# EAGLE design RezzFuzz2 (EAGLE 6.3)
RezFuzz: Based on TurboRat plus Octaver

## Sheet 1 of 2
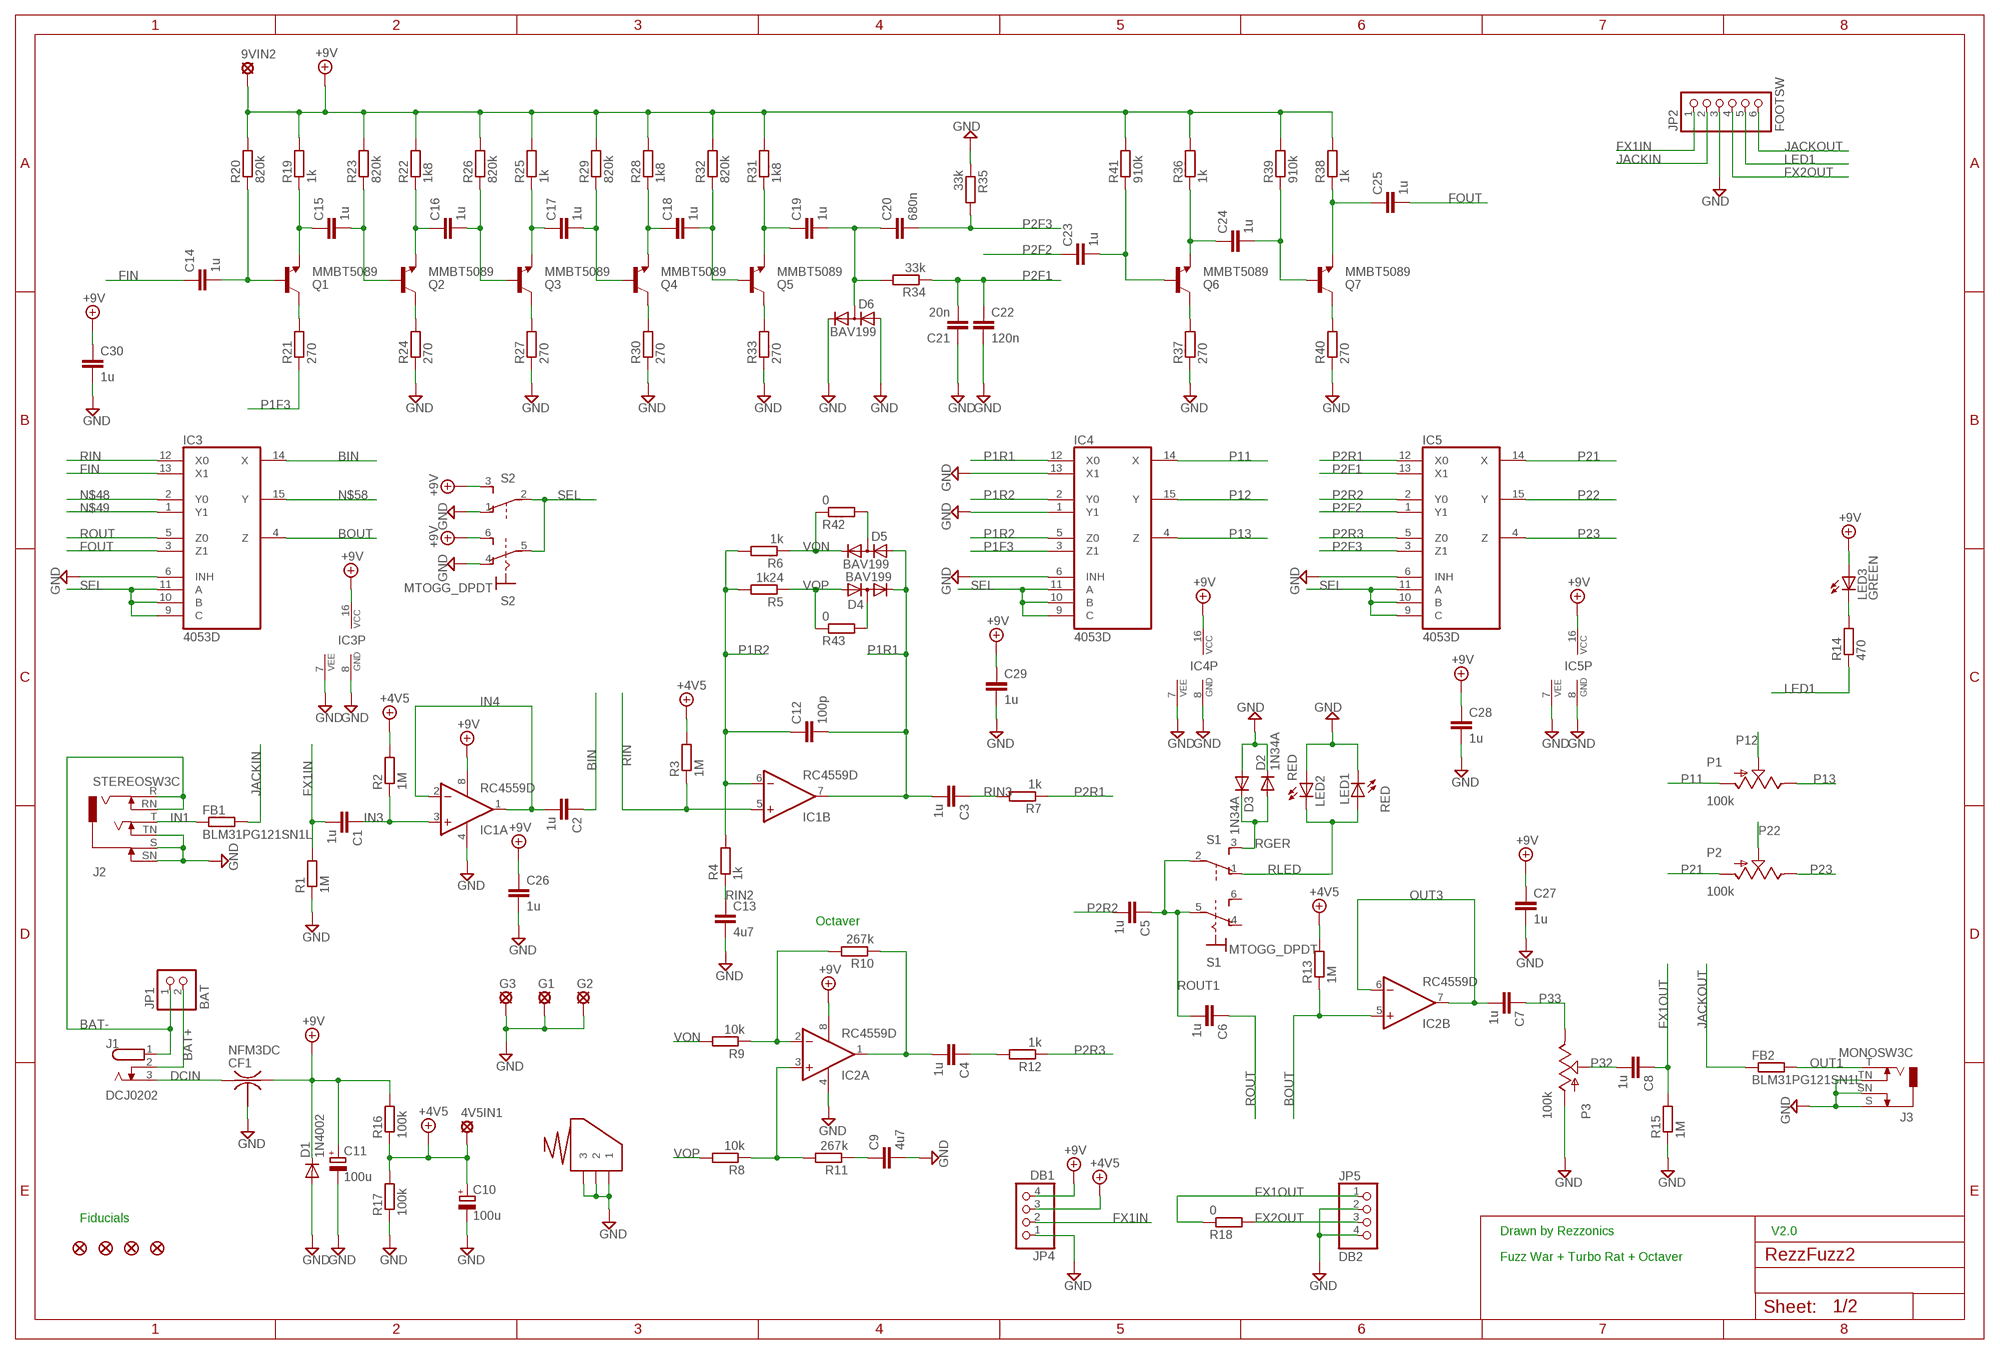
[diagram p0: schematic, sheet 1]

### Parts
4V5IN1  LSP13  [LSP13]
9VIN2  LSP13  [LSP13]
BS1  CLIPAAA-  [CLIPAAA-]
C1  1u  C-EUC0603  [C0603]
C2  1u  C-EUC0603  [C0603]
C3  1u  C-EUC0603  [C0603]
C4  1u  C-EUC0603  [C0603]
C5  1u  C-EUC0603  [C0603]
C6  1u  C-EUC0603  [C0603]
C7  1u  C-EUC0603  [C0603]
C8  1u  C-EUC0603  [C0603]
C9  4u7  C-EUC0805  [C0805]
C10  100u  CPOL-EUD  [PANASONIC_D]
C11  100u  CPOL-EUD  [PANASONIC_D]
C12  100p  C-EUC0603  [C0603]
C13  4u7  C-EUC0805  [C0805]
C14  1u  C-EUC0603  [C0603]
C15  1u  C-EUC0603  [C0603]
C16  1u  C-EUC0603  [C0603]
C17  1u  C-EUC0603  [C0603]
C18  1u  C-EUC0603  [C0603]
C19  1u  C-EUC0603  [C0603]
C20  680n  C-EUC0603  [C0603]
C21  20n  C-EUC0603  [C0603]
C22  120n  C-EUC0603  [C0603]
C23  1u  C-EUC0603  [C0603]
C24  1u  C-EUC0603  [C0603]
C25  1u  C-EUC0603  [C0603]
C26  1u  C-EUC0603  [C0603]
C27  1u  C-EUC0603  [C0603]
C28  1u  C-EUC0603  [C0603]
C29  1u  C-EUC0603  [C0603]
C30  1u  C-EUC0603  [C0603]
CF1  NFM3DC  [NFM3DC]
D1  1N4002  DIODE-DO41-7.6  [DO41-7.6]
D2  1N34A  1N4148DO35-7  [DO35-7]
D3  1N34A  1N4148DO35-7  [DO35-7]
D4  BAV199  [SOT23]
D5  BAV199  [SOT23]
D6  BAV199  [SOT23]
FB1  BLM31PG121SN1L  R-EU_R1206  [R1206]
FB2  BLM31PG121SN1L  R-EU_R1206  [R1206]
G1  LSP13  [LSP13]
G2  LSP13  [LSP13]
G3  LSP13  [LSP13]
IC1  RC4559D  [SO08]
IC2  RC4559D  [SO08]
IC3  4053D  [SO16]
IC4  4053D  [SO16]
IC5  4053D  [SO16]
J1  DCJ0202  [DCJ0202]
J2  STEREOSW3C  [NEUTRIK-NMJ6HCD2]
J3  MONOSW3C  [NEUTRIK-NMJ4HCD2]
JP1  BAT  PINHD-1X2  [1X02]
JP2  FOOTSW  PINHD-1X6  [1X06]
JP3  FIDUCIAL1X2.5  [FIDUCIAL-1X2.5]
JP4  DB1  PINHD-1X4  [1X04]
JP5  DB2  PINHD-1X4  [1X04]
JP6  FIDUCIAL1X2.5  [FIDUCIAL-1X2.5]
JP7  FIDUCIAL1X2.5  [FIDUCIAL-1X2.5]
JP8  FIDUCIAL1X2.5  [FIDUCIAL-1X2.5]
LED1  RED  LEDCHIPLED_1206  [CHIPLED_1206]
LED2  RED  LEDCHIPLED_1206  [CHIPLED_1206]
LED3  GREEN  LED5MM  [LED5MM]
P1  100k  POTMAM  [POT_MAMMOTH]
P2  100k  POTMAM  [POT_MAMMOTH]
P3  100k  POTMAM  [POT_MAMMOTH]
Q1  MMBT5089  TRANSISTOR_NPNSOT23  [SOT23]
Q2  MMBT5089  TRANSISTOR_NPNSOT23  [SOT23]
Q3  MMBT5089  TRANSISTOR_NPNSOT23  [SOT23]
Q4  MMBT5089  TRANSISTOR_NPNSOT23  [SOT23]
Q5  MMBT5089  TRANSISTOR_NPNSOT23  [SOT23]
Q6  MMBT5089  TRANSISTOR_NPNSOT23  [SOT23]
Q7  MMBT5089  TRANSISTOR_NPNSOT23  [SOT23]
R1  1M  R-EU_R0603  [R0603]
R2  1M  R-EU_R0603  [R0603]
R3  1M  R-EU_R0603  [R0603]
R4  1k  R-EU_R0603  [R0603]
R5  1k24  R-EU_R0603  [R0603]
R6  1k  R-EU_R0603  [R0603]
R7  1k  R-EU_R0603  [R0603]
R8  10k  R-EU_R0603  [R0603]
R9  10k  R-EU_R0603  [R0603]
R10  267k  R-EU_R0603  [R0603]
R11  267k  R-EU_R0603  [R0603]
R12  1k  R-EU_R0603  [R0603]
R13  1M  R-EU_R0603  [R0603]
R14  470  R-EU_R0603  [R0603]
R15  1M  R-EU_R0603  [R0603]
R16  100k  R-EU_R0603  [R0603]
R17  100k  R-EU_R0603  [R0603]
R18  0  R-EU_R0603  [R0603]
R19  1k  R-EU_R0603  [R0603]
R20  820k  R-EU_R0603  [R0603]
R21  270  R-EU_R0603  [R0603]
R22  1k8  R-EU_R0603  [R0603]
R23  820k  R-EU_R0603  [R0603]
R24  270  R-EU_R0603  [R0603]
R25  1k  R-EU_R0603  [R0603]
R26  820k  R-EU_R0603  [R0603]
R27  270  R-EU_R0603  [R0603]
R28  1k8  R-EU_R0603  [R0603]
R29  820k  R-EU_R0603  [R0603]
R30  270  R-EU_R0603  [R0603]
R31  1k8  R-EU_R0603  [R0603]
R32  820k  R-EU_R0603  [R0603]
R33  270  R-EU_R0603  [R0603]
R34  33k  R-EU_R0603  [R0603]
R35  33k  R-EU_R0603  [R0603]
R36  1k  R-EU_R0603  [R0603]
R37  270  R-EU_R0603  [R0603]
R38  1k  R-EU_R0603  [R0603]
R39  910k  R-EU_R0603  [R0603]
R40  270  R-EU_R0603  [R0603]
R41  910k  R-EU_R0603  [R0603]
R42  0  R-EU_R0603  [R0603]
R43  0  R-EU_R0603  [R0603]
S1  MTOGG_DPDT  [MTOGGLE_DPDT]
S2  MTOGG_DPDT  [MTOGGLE_DPDT]

### Nets
+4.5V: 4V5IN1.MP C10.+ JP4.3 R2.2 R3.2 R13.2 R16.1 R17.2 ; supply symbol labelled +4V5
+9V: 9VIN2.MP C11.+ C26.1 C27.1 C28.1 C29.1 C30.1 CF1.3 D1.C IC1.8(P:V+) IC2.8(P:V+) IC3.16(VCC) IC4.16(VCC) IC5.16(VCC) JP4.4 LED3.A R16.2 R19.2 R20.2 R22.2 R23.2 R25.2 R26.2 R28.2 R29.2 R31.2 R32.2 R36.2 R38.2 R39.2 R41.2 S2.3(S) S2.6(S)
BAT+ [battery]: J1.2 JP1.2
BAT- [battery]: J1.1 J2.R J2.RN JP1.1
BIN: C2.1 IC3.14(X)
BOUT: IC2.5(B:+IN) IC3.4(Z) R13.1
DCIN: CF1.1 J1.3
FIN: C14.1 IC3.13(X1)
FOUT: C25.2 IC3.3(Z1)
FX1IN: C1.2 JP2.1 JP4.2 R1.2
FX1OUT: C8.1 JP5.1 R15.2 R18.1
FX2OUT: JP2.4 JP5.3 R18.2
GND: BS1.1 BS1.2 BS1.3 C9.2 C10.- C11.- C13.2 C21.1 C22.2 C26.2 C27.2 C28.2 C29.2 C30.2 CF1.2@1 D1.A D2.C D3.A D6.1(A) D6.2(C) G1.MP G2.MP G3.MP IC1.4(P:V-) IC2.4(P:V-) IC3.6(INH) IC3.7(VEE) IC3.8(GND) IC4.1(Y1) IC4.6(INH) IC4.7(VEE) IC4.8(GND) IC4.13(X1) IC5.6(INH) IC5.7(VEE) IC5.8(GND) J2.S J2.SN J2.TN J3.S J3.SN J3.TN JP2.3 JP4.1 JP5.2 JP5.4 LED1.C LED2.A P3.P$1(A) R1.1 R15.1 R17.1 R24.1 R27.1 R30.1 R33.1 R35.1 R37.1 R40.1 S2.1(O) S2.4(O)
IN1: FB1.1 J2.T
IN3: C1.1 IC1.3(A:+IN) R2.1
IN4: C2.2 IC1.1(A:OUT) IC1.2(A:-IN)
JACKIN: FB1.2 JP2.2
JACKOUT: FB2.1 JP2.6
LED1: JP2.5 R14.1
N$1: C14.2 Q1.1(B) R20.1
N$2: Q1.3(C) R21.2
N$3: C16.1 Q2.2(E) R22.1
N$5: Q2.3(C) R24.2
N$8: C16.2 Q3.1(B) R26.1
N$9: C17.1 Q3.2(E) R25.1
N$10: IC2.3(A:+IN) R8.1 R11.2
N$11: IC2.2(A:-IN) R9.1 R10.2
N$12: C9.1 R11.1
N$13: C4.2 IC2.1(A:OUT) R10.1
N$14: C4.1 R12.2
N$15: Q3.3(C) R27.2
N$16: C17.2 Q4.1(B) R29.1
N$17: C18.1 Q4.2(E) R28.1
N$18: Q4.3(C) R30.2
N$19: C18.2 Q5.1(B) R32.1
N$20: C19.1 Q5.2(E) R31.1
N$21: D5.3(AC) R42.2
N$23: Q5.3(C) R33.2
N$24: C19.2 C20.1 D6.3(AC) R34.2
N$25: C24.2 Q7.1(B) R39.1
N$26: C23.2 Q6.1(B) R41.1
N$27: C24.1 Q6.2(E) R36.1
N$29: C25.1 Q7.2(E) R38.1
N$30: Q7.3(C) R40.2
N$31: Q6.3(C) R37.2
N$32: LED3.K(C) R14.2
N$33: C15.2 Q2.1(B) R23.1
N$43: D4.3(AC) R43.2
N$47: C15.1 Q1.2(E) R19.1
N$48: IC3.2(Y0)
N$49: IC3.1(Y1)
N$58: IC3.15(Y)
OUT1: FB2.2 J3.T
OUT3: C7.2 IC2.6(B:-IN) IC2.7(B:OUT)
P1F3: IC4.3(Z1) R21.1
P1R1: C3.2 C12.2 D4.2(C) D5.1(A) IC1.7(B:OUT) IC4.12(X0)
P1R2: C12.1 IC1.6(B:-IN) IC4.2(Y0) IC4.5(Z0) R4.2 R5.2 R6.2
P2F1: C21.2 C22.1 IC5.13(X1) R34.1
P2F2: C23.1 IC5.1(Y1)
P2F3: C20.2 IC5.3(Z1) R35.2
P2R1: IC5.12(X0) R7.1
P2R2: C5.2 IC5.2(Y0)
P2R3: IC5.5(Z0) R12.1
P11: IC4.14(X) P1.P$1(A)
P12: IC4.15(Y) P1.P$2(S)
P13: IC4.4(Z) P1.P$3(E)
P21: IC5.14(X) P2.P$1(A)
P22: IC5.15(Y) P2.P$2(S)
P23: IC5.4(Z) P2.P$3(E)
P32: C8.2 P3.P$2(S)
P33: C7.1 P3.P$3(E)
RGER: D2.A D3.C S1.3(S)
RIN: IC1.5(B:+IN) IC3.12(X0) R3.1
RIN2: C13.1 R4.1
RIN3: C3.1 R7.2
RLED: LED1.A LED2.C S1.1(O)
ROUT: C6.1 IC3.5(Z0)
ROUT1: C5.1 C6.2 S1.2(P) S1.5(P)
SEL: IC3.9(C) IC3.10(B) IC3.11(A) IC4.9(C) IC4.10(B) IC4.11(A) IC5.9(C) IC5.10(B) IC5.11(A) S2.2(P) S2.5(P)
VON: D5.2(C) R6.1 R9.2 R42.1
VOP: D4.1(A) R5.1 R8.2 R43.1
Unconnected: CF1.2@2 S1.4(O) S1.6(S)

### Notes on the sheet
- Octaver
- Fiducials
- Drawn by Rezzonics | V2.0
- Fuzz War + Turbo Rat + Octaver

## Sheet 2 of 2
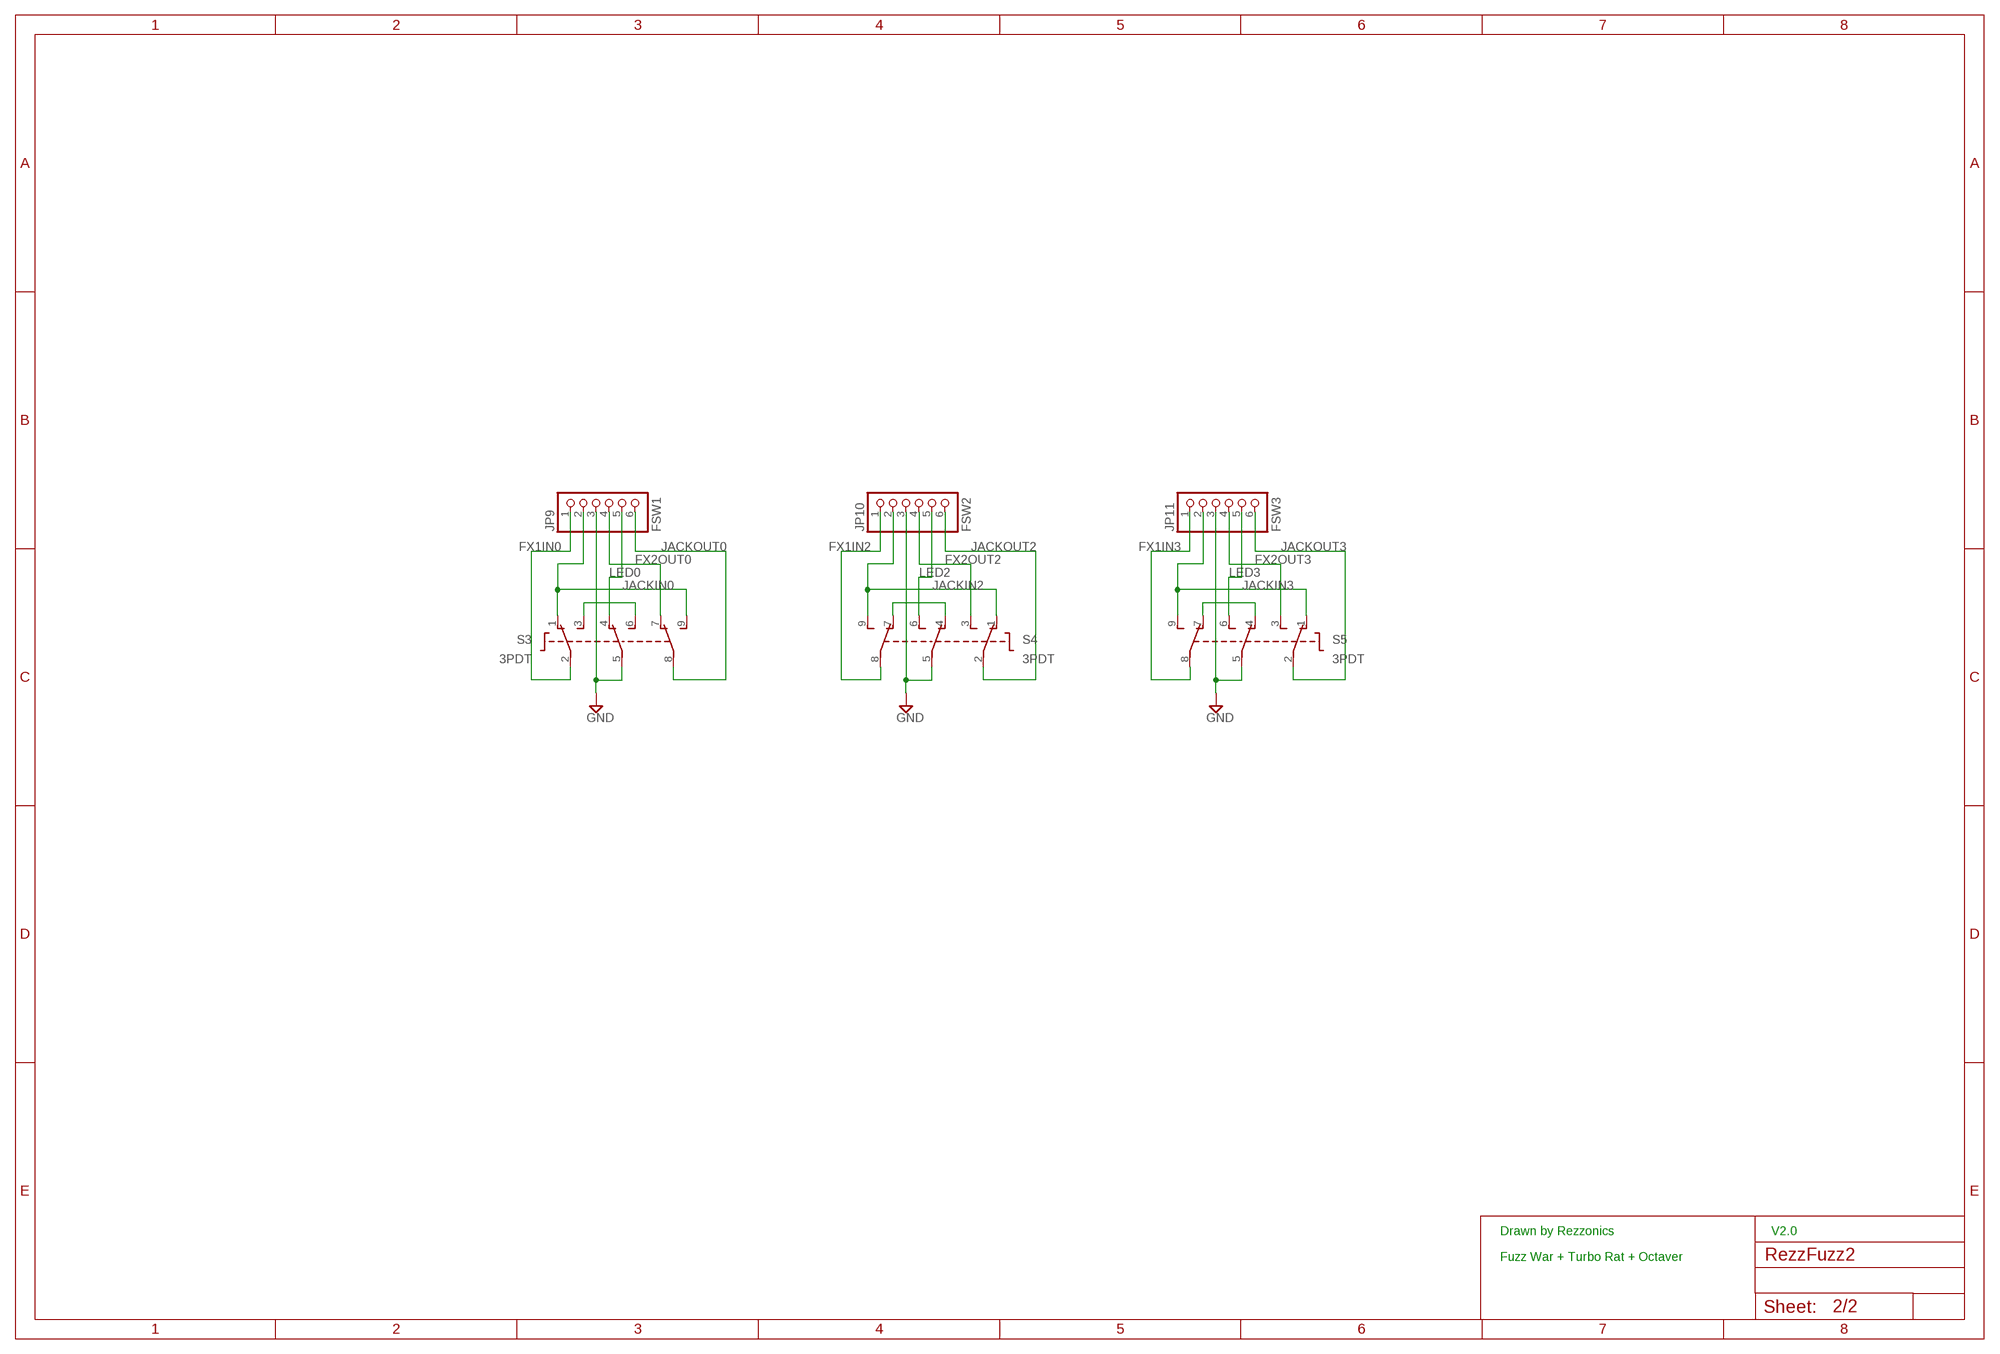
[diagram p1: schematic, sheet 2]

### Parts
JP9  FSW1  PINHD-1X6  [1X06]
JP10  FSW2  PINHD-1X6  [1X06]
JP11  FSW3  PINHD-1X6  [1X06]
S3  3PDT  [3PDT]
S4  3PDT  [3PDT]
S5  3PDT  [3PDT]

### Nets
FX1IN0: JP9.1 S3.2(P1)
FX1IN2: JP10.1 S4.8(P3)
FX1IN3: JP11.1 S5.8(P3)
FX2OUT0: JP9.4 S3.7(O3)
FX2OUT2: JP10.4 S4.3(S1)
FX2OUT3: JP11.4 S5.3(S1)
GND1: JP9.3 S3.5(P2) ; supply symbol labelled GND
GND2: JP10.3 S4.5(P2) ; supply symbol labelled GND
GND3: JP11.3 S5.5(P2) ; supply symbol labelled GND
JACKIN0: JP9.2 S3.1(O1) S3.9(S3)
JACKIN2: JP10.2 S4.1(O1) S4.9(S3)
JACKIN3: JP11.2 S5.1(O1) S5.9(S3)
JACKOUT0: JP9.6 S3.8(P3)
JACKOUT2: JP10.6 S4.2(P1)
JACKOUT3: JP11.6 S5.2(P1)
LED0: JP9.5 S3.4(O2)
LED2: JP10.5 S4.6(S2)
LED3: JP11.5 S5.6(S2)
N$45: S3.3(S1) S3.6(S2)
N$46: S4.4(O2) S4.7(O3)
N$50: S5.4(O2) S5.7(O3)

### Notes on the sheet
- Drawn by Rezzonics | V2.0
- Fuzz War + Turbo Rat + Octaver

## Library data of the parts
4V5IN1 9VIN2 G1-G3 = solpad:LSP13: SOLDER PAD drill 1.3 mm, distributor Buerklin, 12H562; MPN: *
BS1 = battery:CLIPAAA-: Clip battery AAA Negative Spring Keystone 629; MPN: *
C1-C8 C14-C19 C23-C30 = rcl:C-EU: CAPACITOR, European symbol; MF: Murata; MPN: GRM188R61E105KA12J; OC_MOUSER: 81-GRM188R61E105KA2J
C9 C13 = rcl:C-EU: CAPACITOR, European symbol; MF: Murata; MPN: GRM21BR61E475MA12L; OC_MOUSER: 81-GRM21BR61E475MA2L; OC_NEWARK: 24R6340
C10 = rcl:CPOL-EU: POLARIZED CAPACITOR, European symbol; MF: Cornell Dubilier; MPN: AVE107M25X16T-F; OC_MOUSER: 598-AVE107M25X16T-F
C11 = rcl:CPOL-EU: POLARIZED CAPACITOR, European symbol; MF: Cornell-Dubilier; MPN: AVE107M25X16T-F; OC_MOUSER: 598-AVE107M25X16T-F
C12 = rcl:C-EU: CAPACITOR, European symbol; MF: Vishay; MPN: VJ0603Y101MXXCW1BC; OC_MOUSER: 77-VJ0603Y101MXXCBC
C20 = rcl:C-EU: CAPACITOR, European symbol; MF: Kemet; MPN: C0603C684K4PACTU; OC_MOUSER: 80-C0603C684K4P
C21 = rcl:C-EU: CAPACITOR, European symbol; MF: Vishay; MPN: VJ0603Y223KXXCW1BC; OC_MOUSER: 77-VJ0603Y223KXXCBC
C22 = rcl:C-EU: CAPACITOR, European symbol; MF: Murata; MPN: GRM188R71E124KA01D; OC_MOUSER: 81-GRM188R71E124KA1D
CF1 = murata-filter:NFM: EMIFIL(R) (Capacitor type) Single Circuit Type for Signal Lines Source: http://search.murata.co.jp/Ceramy/image/img/PDF/ENG/L0111S0109NFM3DC.pdf; MF: Murata; MPN: NFM3DPC223R1H3L; OC_FARNELL: 1686519; OC_MOUSER: 81-NFM3DPC223R1H3L; OC_NEWARK: 45P3793
D1 = diode:DIODE-: DIODE; MF: Vishay; MPN: 1N4002E-E3/73; OC_MOUSER: 625-1N4002E-E3/73
D2 D3 = diode:1N4148: DIODE high speed (Philips); MF: Microsemi; MPN: 1n34A; OC_FARNELL: 1651088; OC_MOUSER: 526-NTE110A
D4-D6 = diode:BAV199: DIODE low-leakage double diode; MF: NXP; MPN: BAV199,235; OC_MOUSER: 771-BAV199235
FB1 = rcl:R-EU_: RESISTOR, European symbol; MF: Murata; MPN: BLM31PG121SN1L; OC_MOUSER: 81-BLM31PG121SN1L
FB2 = rcl:R-EU_: RESISTOR, European symbol; MF: Murata; MPN: BLM31PG121SN1L
IC1 IC2 = linear:RC4559: OP AMP; MF: Texas Instruments; MPN: RC4559DE4; OC_MOUSER: 595-RC4559DE4
IC3-IC5 = 40xx:4053: Triple 2-channel ANALOG MULTIPLEXER; MF: Texas Instruments; MPN: CD4053BM96G3; OC_MOUSER: 595-CD4053BM96G3
J1 = con-jack:DCJ0202: DC POWER JACK Source: DCJ0202.pdf; MF: Kobiconn; MPN: 163-179PH-EX; OC_FARNELL: unknown; OC_MOUSER: 163-179PH-EX; OC_NEWARK: unknown
J2 = audio jacks 0.25 inch:STEREOSW3C: 1/4" stereo jack, switched, with chrome ferrule and straight PCB pins, mounting nut included; MF: Neutrik; MPN: NMJ6HCD2; OC_MOUSER: 550-22302
J3 = audio jacks 0.25 inch:MONOSW3C: 1/4" mono jack, switched, with chrome ferrule and straight PCB pins, mounting nut included; MF: Neutrik; MPN: NMJ4HCD2; OC_MOUSER: 550-12202
JP1 = pinhead:PINHD-1X2: PIN HEADER; MF: 3M; MPN: 929834-01-02-RK; OC_MOUSER: 649-77311-401-36LF
JP2 = pinhead:PINHD-1X6: PIN HEADER; MF: 3M; MPN: 929834-01-04-RK; OC_MOUSER: 649-77311-401-36LF
JP3 JP6-JP8 = SparkFun:FIDUCIAL: Fiducial Alignment Points Various fiducial points for machine vision alignment.; MPN: *
JP4 JP5 = pinhead:PINHD-1X4: PIN HEADER; MF: 3M; MPN: 929834-01-04-RK; OC_MOUSER: 517-929834-01-04-RK
JP9-JP11 = pinhead:PINHD-1X6: PIN HEADER; MPN: *
LED1 LED2 = led:LED: LED OSRAM: - CHIPLED LG R971, LG N971, LY N971, LG Q971, LY Q971, LO R971, LY R971 LH N974, LH R974 LS Q976, LO Q976, LY Q976 LO Q996 - Hyper CHIPLED LW Q18S LB Q993, LB Q99A, LB R99A - SideLED LS A670, LO A670, LY A670, LG A670, LP A670 LB A673, LV A673, LT A673, LW A673 LH A674 LY A675 LS A676, LA A676, LO A676, LY A676, LW A676 LS A679, LY A679, LG A679 - Hyper Micro SIDELED® LS Y876, LA Y876, LO Y876, LY Y876 LT Y87S - SmartLED LW L88C, LW L88S LB L89C, LB L89S, LG L890 LS L89K, LO L89K, LY L89K LS L896, LA L896, LO L896, LY L896 - TOPLED LS T670, LO T670, LY T670, LG T670, LP T670 LSG T670, LSP T670, LSY T670, LOP T670, LYG T670 LG T671, LOG T671, LSG T671 LB T673, LV T673, LT T673, LW T673 LH T674 LS T676, LA T676, LO T676, LY T676, LB T676, LH T676, LSB T676, LW T676 LB T67C, LV T67C, LT T67C, LS T67K, LO T67K, LY T67K, LW E67C LS E67B, LA E67B, LO E67B, LY E67B, LB E67C, LV E67C, LT E67C LW T67C LS T679, LY T679, LG T679 LS T770, LO T770, LY T770, LG T770, LP T770 LB T773, LV T773, LT T773, LW T773 LH T774 LS E675, LA E675, LY E675, LS T675 LS T776, LA T776, LO T776, LY T776, LB T776 LHGB T686 LT T68C, LB T68C - Hyper Mini TOPLED® LB M676 - Mini TOPLED Santana® LG M470 LS M47K, LO M47K, LY M47K Source: http://www.osram.convergy.de LUXEON: - LUMILED® LXK2-PW12-R00, LXK2-PW12-S00, LXK2-PW14-U00, LXK2-PW14-V00 LXK2-PM12-R00, LXK2-PM12-S00, LXK2-PM14-U00 LXK2-PE12-Q00, LXK2-PE12-R00, LXK2-PE12-S00, LXK2-PE14-T00, LXK2-PE14-U00 LXK2-PB12-K00, LXK2-PB12-L00, LXK2-PB12-M00, LXK2-PB14-N00, LXK2-PB14-P00, LXK2-PB14-Q00 LXK2-PR12-L00, LXK2-PR12-M00, LXK2-PR14-Q00, LXK2-PR14-R00 LXK2-PD12-Q00, LXK2-PD12-R00, LXK2-PD12-S00 LXK2-PH12-R00, LXK2-PH12-S00 LXK2-PL12-P00, LXK2-PL12-Q00, LXK2-PL12-R00 Source: www.luxeon.com KINGBRIGHT: KA-3528ASYC Source: www.kingbright.com; MF: Dialight; MPN: 598-8210-107F; OC_MOUSER: 645-598-8210-107F
LED3 = led:LED: LED OSRAM: - CHIPLED LG R971, LG N971, LY N971, LG Q971, LY Q971, LO R971, LY R971 LH N974, LH R974 LS Q976, LO Q976, LY Q976 LO Q996 - Hyper CHIPLED LW Q18S LB Q993, LB Q99A, LB R99A - SideLED LS A670, LO A670, LY A670, LG A670, LP A670 LB A673, LV A673, LT A673, LW A673 LH A674 LY A675 LS A676, LA A676, LO A676, LY A676, LW A676 LS A679, LY A679, LG A679 - Hyper Micro SIDELED® LS Y876, LA Y876, LO Y876, LY Y876 LT Y87S - SmartLED LW L88C, LW L88S LB L89C, LB L89S, LG L890 LS L89K, LO L89K, LY L89K LS L896, LA L896, LO L896, LY L896 - TOPLED LS T670, LO T670, LY T670, LG T670, LP T670 LSG T670, LSP T670, LSY T670, LOP T670, LYG T670 LG T671, LOG T671, LSG T671 LB T673, LV T673, LT T673, LW T673 LH T674 LS T676, LA T676, LO T676, LY T676, LB T676, LH T676, LSB T676, LW T676 LB T67C, LV T67C, LT T67C, LS T67K, LO T67K, LY T67K, LW E67C LS E67B, LA E67B, LO E67B, LY E67B, LB E67C, LV E67C, LT E67C LW T67C LS T679, LY T679, LG T679 LS T770, LO T770, LY T770, LG T770, LP T770 LB T773, LV T773, LT T773, LW T773 LH T774 LS E675, LA E675, LY E675, LS T675 LS T776, LA T776, LO T776, LY T776, LB T776 LHGB T686 LT T68C, LB T68C - Hyper Mini TOPLED® LB M676 - Mini TOPLED Santana® LG M470 LS M47K, LO M47K, LY M47K Source: http://www.osram.convergy.de LUXEON: - LUMILED® LXK2-PW12-R00, LXK2-PW12-S00, LXK2-PW14-U00, LXK2-PW14-V00 LXK2-PM12-R00, LXK2-PM12-S00, LXK2-PM14-U00 LXK2-PE12-Q00, LXK2-PE12-R00, LXK2-PE12-S00, LXK2-PE14-T00, LXK2-PE14-U00 LXK2-PB12-K00, LXK2-PB12-L00, LXK2-PB12-M00, LXK2-PB14-N00, LXK2-PB14-P00, LXK2-PB14-Q00 LXK2-PR12-L00, LXK2-PR12-M00, LXK2-PR14-Q00, LXK2-PR14-R00 LXK2-PD12-Q00, LXK2-PD12-R00, LXK2-PD12-S00 LXK2-PH12-R00, LXK2-PH12-S00 LXK2-PL12-P00, LXK2-PL12-Q00, LXK2-PL12-R00 Source: www.luxeon.com KINGBRIGHT: KA-3528ASYC Source: www.kingbright.com; MF: Cree Inc.; MPN: C5SMF-GJS-CV14Q7S1; OC_MOUSER: 941-C5SMFGJSCV14Q7S1
P1 P2 = SparkFun:POT; MF: Alpha-Taiwan; MPN: RV16AF-41-15R1-B100K
P3 = SparkFun:POT; MF: Alpha-Taiwan; MPN: RV16AF-41-15R1-A100K
Q1-Q7 = SparkFun:TRANSISTOR_NPN: Transistor NPN BJT configuration in SOT23 package. MMBT2222 is the common NPN we use. Double check BCE configuration again layout.; MF: Fairchild Semiconductor; MPN: MMBT5089; OC_MOUSER: 512-MMBT5089
R1-R4 R13 R15 = rcl:R-EU_: RESISTOR, European symbol; MF: Bourns; MPN: CR0603-FX-1004ELF; OC_MOUSER: 652-CR0603-FX-1004ELF
R5 = rcl:R-EU_: RESISTOR, European symbol; MF: Bourns; MPN: CR0603-FX-1241ELF; OC_MOUSER: 652-CR0603-FX-1241ELF
R6 R7 R12 = rcl:R-EU_: RESISTOR, European symbol; MF: Bourns; MPN: CR0603-FX-1001HLF; OC_MOUSER: 652-CR0603-FX-1001HLF
R8 R9 = rcl:R-EU_: RESISTOR, European symbol; MF: Bourns; MPN: CR0603-FX-1002HLF; OC_MOUSER: 652-CR0603-FX-1002HLF
R10 R11 = rcl:R-EU_: RESISTOR, European symbol; MF: Bourns; MPN: CR0603-FX-2673ELF; OC_MOUSER: 652-CR0603-FX-2673ELF
R14 = rcl:R-EU_: RESISTOR, European symbol; MF: Bourns; MPN: CR0603-FX-4700ELF; OC_MOUSER: 652-CR0603-FX-4700ELF
R16 R17 R19 R25 = rcl:R-EU_: RESISTOR, European symbol; MF: Bourns; MPN: CR0603-FX-1003ELF; OC_MOUSER: 652-CR0603-FX-1003ELF
R18 R42 R43 = rcl:R-EU_: RESISTOR, European symbol; MF: Vishay/Dale; MPN: CRCW06030000ZSTB; OC_MOUSER: 71-CRCW0603000ZT-RT5
R20 R23 R26 R29 R32 = rcl:R-EU_: RESISTOR, European symbol; MF: Bourns; MPN: CR0603-FX-4303ELF; OC_MOUSER: 652-CR0603-FX-4303ELF
R21 R24 R27 R30 R33 R37 R40 = rcl:R-EU_: RESISTOR, European symbol; MF: Bourns; MPN: CR0603-FX-3900ELF; OC_MOUSER: 652-CR0603-FX-3900ELF
R22 R28 R31 R36 R38 = rcl:R-EU_: RESISTOR, European symbol; MF: Bourns; MPN: CR0603-FX-1803ELF; OC_MOUSER: 652-CR0603-FX-1803ELF
R34 R35 = rcl:R-EU_: RESISTOR, European symbol; MF: Bourns; MPN: CR0603-FX-3302ELF; OC_MOUSER: 652-CR0603-FX-3302ELF
R39 R41 = rcl:R-EU_: RESISTOR, European symbol; MF: Bourns; MPN: CR0603-FX-9103ELF; OC_MOUSER: 652-CR0603-FX-9103ELF
S1 = switch:MTOGG_DPDT: Miniature toggle NKK Series M202x DPDT SP3T http://fr.mouser.com/ProductDetail/NKK-Switches/M2024SS1W03/?qs=sGAEpiMZZMvudeGI7i40XNXjdXsj23H5KySuuSRCSqY%3d; MF: NKK switches; MPN: M2023SS1W03; OC_MOUSER: 633-M2023SS1W03
S2 = switch:MTOGG_DPDT: Miniature toggle NKK Series M202x DPDT SP3T http://fr.mouser.com/ProductDetail/NKK-Switches/M2024SS1W03/?qs=sGAEpiMZZMvudeGI7i40XNXjdXsj23H5KySuuSRCSqY%3d; MF: NKK switches; MPN: M2022SS1W03; OC_MOUSER: 633-M2022SS1W03
S3-S5 = switch:3PDT: 3PDT 9 pin footswitch SF17020F-0302-21R-L Source: 3PDT.jpg; MPN: *

## Net classes
1 power: width 0.305 mm, drill 0.203 mm, clearance 0.203 mm to class 0, clearance 0.203 mm
2 battery: width 0.61 mm, drill 0.203 mm, clearance 0.406 mm to class 0, clearance 0.406 mm to class 1

## Board
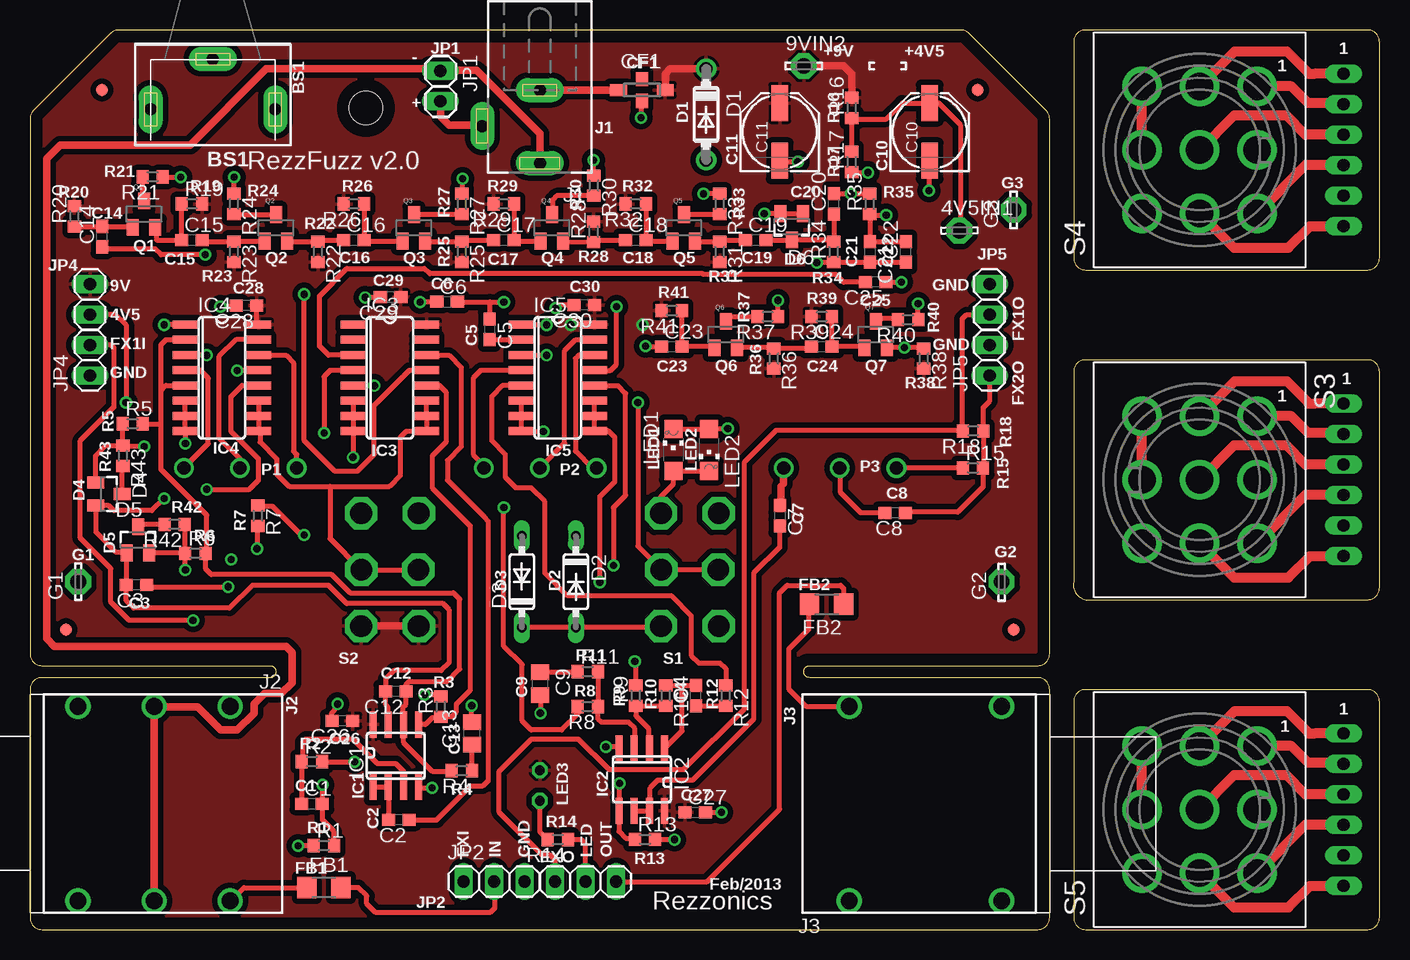
[diagram p2: board, top side]
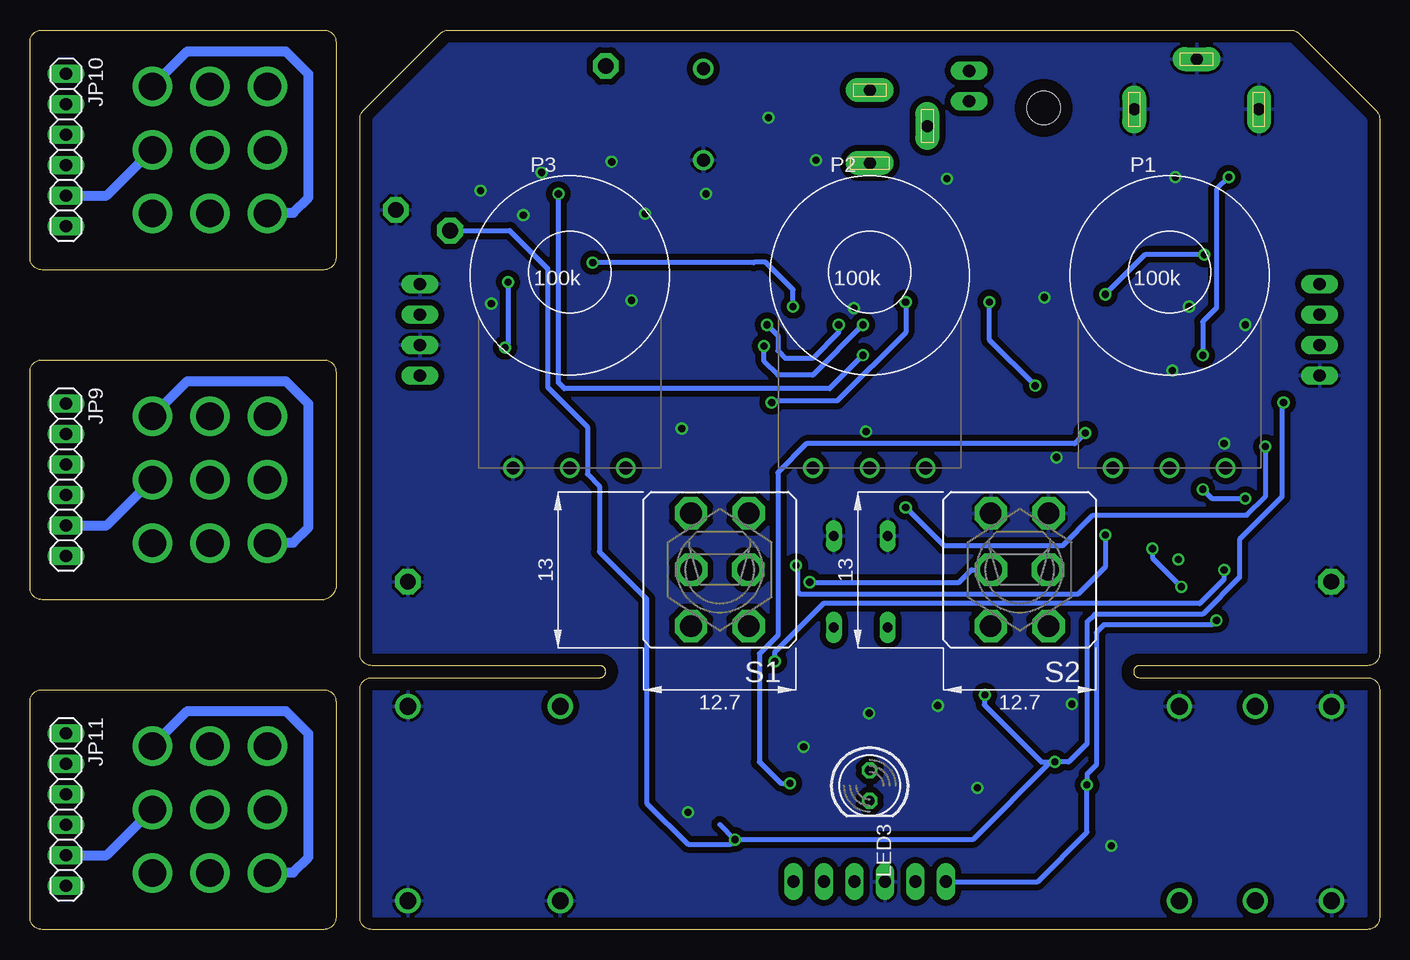
[diagram p3: board, bottom side, seen from below]

Size 112.5 x 75 mm. Coordinates in mm from the lower left corner, seen from the top.
Outline: 20,21 1,21 arc90 0,20 0,1 arc90 1,0 84,0 arc90 85,1 85,20 arc90 84,21 65,21 arc-90 64.5,21.5 arc-90 65,22 84,22 arc90 85,23 85,67.59 arc45 84.71,68.29 78.29,74.71 arc45 77.59,75 7.41,75 arc45 6.71,74.71 0.29,68.29 arc45 0,67.59 0,23 arc90 1,22 20,22 arc-90 20.5,21.5 arc-90 20,21
Outline: 88,55 111.5,55 arc90 112.5,56 112.5,74 arc90 111.5,75 88,75 arc90 87,74 87,56 arc90 88,55
Outline: 88,27.5 111.5,27.5 arc90 112.5,28.5 112.5,46.5 arc90 111.5,47.5 88,47.5 arc90 87,46.5 87,29 arc90 88,27.5
Outline: 111.5,20 88,20 arc90 87,19 87,1 arc90 88,0 111.5,0 arc90 112.5,1 112.5,19 arc90 111.5,20
Copper layers (1*16): Top 0.035mm / dielectric 1.5mm / Bottom 0.035mm
Design rules "default": minimum track width 10mil, minimum drill 23mil, track to track 8mil, track to pad 8mil, pad to pad 8mil, via to via 8mil, smd to smd 8mil, copper to edge 40mil, drill to drill 8mil, minimum pad ring 10mil, minimum via ring 8mil, stop-mask expansion 4mil, vias tented up to drill 0mil, thermal gap 10mil
Holes 2.8 mm at 28,68.5

### Footprints (pad centres in the part's own frame; a part is rotated, then mirrored left to right if it is on the bottom)
LSP13 = drill 1.321 pad 2.159 octagon: MP 0,0
CLIPAAA- = drill 1 pad 2 long: 1 0,-4.2; 2 5.2,0; 3 -5.2,0
C0603 = smd 1.1 x 1: 1 -0.85,0; 2 0.85,0
C0805 = smd 1.3 x 1.5: 1 -0.95,0; 2 0.95,0
PANASONIC_D = smd 3 x 1.4: + 2.4,0; - -2.4,0
NFM3DC = smd 1.4 x 1: 1 -1.95,0; 3 1.95,0 | smd 1 x 1.2: 2@1 0,-0.9; 2@2 0,0.9
DO41-7.6 = drill 1.1 pad 1.7: A 3.81,0; C -3.81,0
DO35-7 = drill 0.813 long: A 3.81,0; C -3.81,0
SOT23 = smd 1 x 1.4: 1 -0.95,-1.1; 2 0.95,-1.1; 3 0,1.1
R1206 = smd 1.6 x 1.803: 1 -1.422,0; 2 1.422,0
SO08 = smd 0.6 x 2.2: 1 -1.905,-2.6; 2 -0.635,-2.6; 3 0.635,-2.6; 4 1.905,-2.6; 5 1.905,2.6; 6 0.635,2.6; 7 -0.635,2.6; 8 -1.905,2.6
SO16 = smd 0.66 x 2.032: 1 -4.445,-3.073; 2 -3.175,-3.073; 3 -1.905,-3.073; 4 -0.635,-3.073; 5 0.635,-3.073; 6 1.905,-3.073; 7 3.175,-3.073; 8 4.445,-3.073; 9 4.445,3.073; 10 3.175,3.073; 11 1.905,3.073; 12 0.635,3.073; 13 -0.635,3.073; 14 -1.905,3.073; 15 -3.175,3.073; 16 -4.445,3.073
DCJ0202 = drill 1 pad 2 long: 1 0,3.1; 2 4.8,0; 3 0,-3
NEUTRIK-NMJ6HCD2 = drill 1.4: R -8.115,-10.35; RN 8.115,-10.35; S -8.115,-4; SN 8.115,-4; T -8.115,-16.7; TN 8.115,-16.7
NEUTRIK-NMJ4HCD2 = drill 1.4: S -8.115,-4; SN 8.115,-4; T -8.115,-16.7; TN 8.115,-16.7
1X02 = drill 1.016 long: 1 -1.27,0; 2 1.27,0
1X06 = drill 1.016 long: 1 -6.35,0; 2 -3.81,0; 3 -1.27,0; 4 1.27,0; 5 3.81,0; 6 6.35,0
FIDUCIAL-1X2.5 = smd 1 x 1: 1 0,0
1X04 = drill 1.016 long: 1 -3.81,0; 2 -1.27,0; 3 1.27,0; 4 3.81,0
CHIPLED_1206 = smd 1.5 x 1.5: A 0,-1.75; C 0,1.75
LED5MM = drill 0.813 octagon: A -1.27,0; K 1.27,0
POT_MAMMOTH = drill 1.1: P$1 -4.73,-0.02; P$2 0,-0.02; P$3 4.67,-0.01
R0603 = smd 1 x 1.1: 1 -0.85,0; 2 0.85,0
MTOGGLE_DPDT = drill 1.8 octagon: 1 -2.4,-4.7; 2 -2.388,0; 3 -2.4,4.7; 4 2.4,-4.7; 5 2.388,0; 6 2.4,4.7
3PDT = drill 2.3 pad 3.1: 1 -5.3,4.8; 2 -5.3,0; 3 -5.3,-4.8; 4 0,4.8; 5 0,0; 6 0,-4.8; 7 5.3,4.8; 8 5.3,0; 9 5.3,-4.8

### Placement (x,y rotation side)
4V5IN1  77.47,58.28 0 top
9VIN2  64.5,72 0 top
BS1  15.25,68.38 180 top
C1  23.5,10.5 0 top
C2  30.75,9.15 180 top
C3  8.87,28.73 180 top
C4  55.5,19.5 90 top
C5  38.31,50.04 270 top
C6  34.77,52.34 0 top
C7  62.5,34.5 270 top
C8  72.12,34.75 180 top
C9  42.5,20.5 270 top
C10  75,66.5 90 top
C11  62.5,66.5 90 top
C12  30.5,19.86 180 top
C13  36.86,16.36 90 top
C14  6,57.77 90 top
C15  13.5,57.5 0 top
C16  27,57.5 0 top
C17  39.5,57.5 0 top
C18  50.5,57.5 0 top
C19  60.5,57.5 0 top
C20  67,60.5 90 top
C21  70,56.5 270 top
C22  73,56.5 90 top
C23  53.5,48.6 0 top
C24  66,48.6 0 top
C25  70.5,53.98 180 top
C26  26.04,17.4 180 top
C27  55.46,9.77 0 top
C28  18.03,52.02 180 top
C29  30.07,52.71 180 top
C30  46.2,52.07 180 top
CF1  51,70 0 top
D1  56.36,67.96 270 top
D2  45.5,29 270 top
D3  41,29 90 top
D4  6.58,36.3 270 top
D5  9,32.48 0 top
D6  63.5,58.6 180 top
FB1  24.5,3.5 0 top
FB2  66.41,27.12 180 top
G1  4.02,29 90 top
G2  81,29 90 top
G3  82,60 90 top
IC1  30.5,14.5 0 top
IC2  51,12.5 180 top
IC3  30,46 270 top
IC4  16,46 270 top
IC5  44,46 270 top
J1  42.5,67 180 top
J2  0,10.5 90 top
J3  85,10.5 270 top
JP1  34.21,70.32 270 top
JP2  42.5,4 0 top
JP3  82,25 0 top
JP4  5,50 90 top
JP5  80,50 90 top
JP6  3,25 0 top
JP7  6,70 0 top
JP8  79,70 0 top
JP9  109.5,37.5 270 bottom
JP10  109.5,65 270 bottom
JP11  109.5,10 270 bottom
LED1  53.64,40 0 top
LED2  56.61,40 180 top
LED3  42.5,12 270 bottom
P1  17.5,38.5 0 bottom
P2  42.5,38.5 0 bottom
P3  67.5,38.5 0 bottom
Q1  9.5,59.64 0 top
Q2  20.5,58.5 0 top
Q3  32,58.5 0 top
Q4  43.5,58.5 0 top
Q5  54.5,58.5 0 top
Q6  58,49.6 0 top
Q7  70.5,49.6 0 top
R1  24.5,7 0 top
R2  23.5,14 0 top
R3  34.25,18.59 90 top
R4  35.98,13.25 180 top
R5  8.56,42.17 0 top
R6  13.8,31.36 0 top
R7  19,34.5 270 top
R8  46.49,18.59 180 top
R9  50.5,19.5 90 top
R10  53,19.5 270 top
R11  46.5,21.5 0 top
R12  58,19.5 270 top
R13  51.27,7.52 0 top
R14  44,7.5 180 top
R15  78.6,38.48 0 top
R16  68.5,68.5 90 top
R17  68.5,64 90 top
R18  78.63,41.57 180 top
R19  13.5,60.5 0 top
R20  3.7,59.47 90 top
R21  10.22,62.75 180 top
R22  24,56.5 270 top
R23  17,56.5 270 top
R24  17,60.5 270 top
R25  36,56.5 270 top
R26  27,60.5 180 top
R27  36,60.5 270 top
R28  46.98,58.18 90 top
R29  39.5,60.5 180 top
R30  47,62.02 270 top
R31  57.5,56.5 270 top
R32  50.5,60.5 180 top
R33  57.5,60.5 270 top
R34  67,56.5 90 top
R35  70,60.5 90 top
R36  62,47.6 270 top
R37  61.5,51.1 180 top
R38  74.5,47.6 270 top
R39  66,51.1 180 top
R40  73.19,50.85 180 top
R41  53.5,51.6 180 top
R42  12.06,33.78 180 top
R43  7.75,39.5 270 top
S1  55,30 180 bottom
S2  30,30 180 bottom
S3  97.5,37.5 270 top
S4  97.5,65 90 top
S5  97.5,10 90 top

### Tracks (layer width: path | path; a pad name or v marks a point on that pad's centre or on a via)
+4.5V  (via drill 0.6)
  Top 0.406: R17.2 R16.1 68.71,67.44 68.84,67.56 71.37,67.56 72.71,68.9 C10.+ 75.75,68.9 77.6,67.06 77.6,58.41 4V5IN1.MP | R2.2 24.38,13.97 v27.05,13.97 | JP4.3 5.04,51.31 7.11,51.31 8,50.42 v8,43.94 | R3.2 34.12,19.56 v32.89,19.56 | v53.72,7.49 52.14,7.49 R13.2
  Bottom 0.406: v27.05,13.97 27.43,13.97 33.91,7.49 v53.72,7.49 | v27.05,13.97 28.19,13.97 32.96,18.73 32.96,19.49 v32.89,19.56 | v8,43.94 8.13,43.81 8.13,36.07 11.68,32.51 11.68,29.34 14.73,26.29 23.75,26.29 24.38,25.65 24.38,15.49 25.91,13.97 v27.05,13.97 | v53.72,7.49 54.99,8.76 | 4V5IN1.MP 72.51,58.28 69.34,55.12 69.34,45.21 66.04,41.91 66.04,37.97 65.02,36.96 65.02,31.5 61.09,27.56 61.09,10.54 57.66,7.11 54.1,7.11 v53.72,7.49
+9V  (via drill 0.6)
  Top 0.406: IC2.8 | IC4.16 18.88,50.63 C28.1 | IC5.16 47.05,50.42 v45.09,50.42
  Top 0.61: D1.C 53.35,71.77 52.96,71.37 CF1.3 | R16.2 68.5,71.33 67.82,72.01 9VIN2.MP | S2.3 S2.6 | 57.55,55.6 R31.2
  Bottom 0.406: v45.09,50.42 45.09,49.78 47.24,47.62 49.53,47.62 50.16,48.26 50.16,49.53 v51.05,50.42
  pour Top (isolate 0.457): -0.77,74.95 -0.27,-1.27 85.49,-1.27 84.99,74.95
BAT+
  Top 0.61: JP1.2 34.21,67.77 34.92,67.06 37.64,67.06 J1.2
BAT-
  Top 0.61: J2.R J2.RN 10.42,18.54 13.97,18.54 15.88,16.64 17.27,16.64 18.67,18.03 18.67,18.8 19.56,19.68 20.95,19.68 21.84,20.57 21.84,23.11 21.34,23.62 2.03,23.62 1.4,24.26 1.4,64.26 2.54,65.41 13.34,65.41 19.68,71.75 34.05,71.75 JP1.1 34.25,71.63 37.21,71.63 42.5,66.34 J1.1
BIN
  Top 0.406: IC3.14 33.1,47.88 34.92,47.88 35.94,46.86 35.94,40.26 34.8,39.12 34.8,37.47 37.59,34.67 37.85,34.42 38.23,34.04 38.23,12.45 37.72,11.94 36.7,11.94 33.91,9.14 31.61,9.14 C2.1
BOUT  (via drill 0.6)
  Top 0.406: IC2.5 49.15,9.85 | IC3.4 26.9,46.61 25.02,46.61 24.51,46.1 v24.51,41.4 | v49.15,12.19 49.09,12.14 IC2.5 | IC2.5 49.09,8.18 49.66,7.62 50.32,7.62 R13.1
  Bottom 0.406: v49.15,12.19 49.91,12.19 51.69,13.97 51.69,22.99 50.16,24.51 50.16,38.1 47.75,40.51 25.4,40.51 v24.51,41.4
DCIN
  Top 0.61: J1.3 CF1.1
FIN  (via drill 0.6)
  Top 0.406: 33.1,46.61 IC3.13 33.05,46.61 31.62,46.61 31.43,46.42 31.11,46.1 28.7,43.69 28.7,39.62 27.3,38.23 25.4,38.23 22.86,40.77 v22.86,52.96 | C14.1 6.15,56.77 10.41,56.77 10.92,56.26 v14.61,56.26
  Bottom 0.406: v14.61,56.26 19.56,56.26 v22.86,52.96
FOUT
  Top 0.406: 26.95,47.88 IC3.3 26.9,47.88 24.89,47.88 24.13,48.64 24.13,52.83 26.42,55.12 32.89,55.12 33.21,54.8 33.34,54.67 56.07,54.67 56.13,54.61 67.18,54.61 67.82,53.98 C25.2
FX1IN  (via drill 0.6)
  Top 0.406: v13.59,25.78 8.26,25.78 6.73,27.3 6.73,30.1 4.19,32.64 4.19,40.77 6.99,43.56 6.99,48.51 6.77,48.73 JP4.2 6.51,48.73 | v24.38,12.06 24.38,10.53 C1.2 24.38,10.47 24.38,9.14 25.35,8.18 R1.2 25.4,7.05
  Bottom 0.406: JP2.1 28.5,4 24.38,8.12 v24.38,12.06 24.38,12.95 23.62,13.72 23.62,24.77 22.99,25.4 13.97,25.4 v13.59,25.78
FX1IN0
  Top 0.813: JP9.1 107.06,43.85 106.64,43.85 | 106.64,43.85 106.58,43.85 | S3.2 100.42,45.72 104.78,45.72 106.64,43.85
FX1IN2
  Top 0.813: JP10.1 107.06,71.35 106.64,71.35 | 106.64,71.35 106.58,71.35 | S4.8 100.42,73.22 104.78,73.22 106.64,71.35
FX1IN3
  Top 0.813: JP11.1 107.06,16.35 106.64,16.35 | 106.64,16.35 106.58,16.35 | S5.8 100.42,18.22 104.78,18.22 106.64,16.35
FX1OUT
  Top 0.406: JP5.1 80.01,44.07 79.48,43.54 R18.1 79.48,38.51 R15.2 79.45,36.91 77.34,34.8 73.02,34.8 C8.1
FX2OUT
  Top 0.406: 77.72,41.62 77.72,50.93 78.07,51.27 JP5.3 | JP2.4 43.77,5.8 43.34,6.22 42.67,6.22 39.12,9.78 39.12,13.21 41.78,15.88 45.72,15.88 48.26,13.34 54.48,13.34 59.56,18.41 59.56,38.99 62.19,41.62 77.72,41.62 | 77.72,41.62 R18.2
FX2OUT0
  Top 0.813: JP9.4 106.33,36.23 S3.7
FX2OUT2
  Top 0.813: JP10.4 106.33,63.73 S4.3
FX2OUT3
  Top 0.813: JP11.4 106.33,8.73 S5.3
GND  (via drill 0.6)
  Top 0.406: v12.95,40.51 12.95,41.53 IC4.8 IC4.7 IC4.6 | IC4.1 12.9,50.42 v11.18,50.42 | C28.2 17.11,51.94 v15.88,51.94 | IC4.13 19.05,46.61 v17.27,46.61 | IC3.6 26.95,44.07 26.93,44.04 IC3.7 IC3.8 v26.93,39.37 v26.92,39.37 | R24.1 17.02,61.37 v17.02,62.74 | R27.1 36.07,61.42 v36.07,62.61 | CF1.2@1 50.93,69.03 v50.93,67.69 | R30.1 46.99,62.88 v46.99,64.14 | R33.1 v56.13,61.34 | v61.21,59.69 D6.2 D6.1 | C11.- 62.59,64.01 v64.01,64.01 | C10.- 74.93,64.03 v74.93,61.59 | C22.2 C21.1 R35.1 70.09,59.56 v71.37,59.56 | R17.1 68.53,63.12 v69.85,63.12 | R40.1 v74.04,52.2 | LED1.C LED2.A 56.64,41.78 v58.17,41.78 | R37.1 v62.36,52.45 | v42.8,41.53 40.95,41.53 IC5.8 IC5.7 IC5.6 | IC1.4 32.49,11.81 v33.53,11.81 | R1.1 23.64,6.99 v22.35,6.99 | C26.2 25.27,17.48 25.15,17.61 25.15,18.03 25.65,18.54 v25.65,18.8 | C9.2 42.55,19.5 v42.55,18.03 | IC2.4 48.95,15.24 v48.01,15.24 | C27.2 v57.66,9.78 | 29.21,52.45 C29.2 28.97,52.7 v27.94,52.7 | C13.2 36.83,17.33 v36.83,18.67 | C30.2 44.07,52.07 v43.81,51.82 | R15.1 P3.P$1
  pour Bottom (isolate 0.508): -0.5,-0.5 85.5,-0.5 85.5,75.5 -0.5,75.5
GND1
  Top 0.813: JP9.3 106.33,38.77 104.71,40.39 100.39,40.39 S3.5
GND2
  Top 0.813: JP10.3 106.33,66.27 104.71,67.89 100.39,67.89 S4.5
GND3
  Top 0.813: JP11.3 106.33,11.27 104.71,12.89 100.39,12.89 S5.5
IN1
  Top 0.406: J2.T 17.82,3.5 FB1.1
IN3
  Top 0.406: C1.1 R2.1 22.73,14.08 22.73,15.62 22.99,15.88 26.92,15.88 28.96,13.84 30.48,13.84 31.14,13.19 IC1.3 31.11,11.92
IN4
  Top 0.406: IC1.1 IC1.2 29.9,11.86 C2.2
JACKIN
  Top 0.406: 25.91,3.51 FB1.2 27.36,3.5 28.07,2.79 28.07,2.16 28.83,1.4 38.35,1.4 38.73,1.78 38.73,3.96 JP2.2
JACKIN0
  Top 0.813: JP9.2 109.41,41.4 106.55,41.4 105.16,42.8 S3.1
  Bottom 0.813: S3.1 99.38,45.72 91.19,45.72 89.28,43.81 89.28,33.53 90.55,32.26 92.64,32.26 S3.9
JACKIN2
  Top 0.813: JP10.2 109.41,68.9 106.55,68.9 105.16,70.3 S4.9
  Bottom 0.813: S4.9 99.38,73.22 91.19,73.22 89.28,71.31 89.28,61.03 90.55,59.76 92.64,59.76 S4.1
JACKIN3
  Top 0.813: JP11.2 109.41,13.9 106.55,13.9 105.16,15.3 S5.9
  Bottom 0.813: S5.9 99.38,18.22 91.19,18.22 89.28,16.32 89.28,6.03 90.55,4.76 92.64,4.76 S5.1
JACKOUT
  Top 0.406: FB2.1 67.82,27.14 67.82,28.45 67.56,28.7 63.12,28.7 62.48,28.07 62.48,10.03 56.45,4 JP2.6
JACKOUT0
  Top 0.813: JP9.6 109.47,31.11 106.68,31.11 104.9,29.34 100.36,29.34 S3.8
JACKOUT2
  Top 0.813: JP10.6 109.47,58.62 106.68,58.62 104.9,56.84 100.36,56.84 S4.2
JACKOUT3
  Top 0.813: JP11.6 109.47,3.62 106.68,3.62 104.9,1.84 100.36,1.84 S5.2
LED0
  Bottom 0.813: JP9.5 106.11,33.69 S3.4
LED1
  Top 0.406: JP2.5 46.31,7.16 45.97,7.49 R14.1
LED2
  Bottom 0.813: JP10.5 106.11,61.19 S4.6
LED3
  Bottom 0.813: JP11.5 106.11,6.19 S5.6
N$1
  Top 0.406: R20.1 C14.2 8.55,58.62 Q1.1
N$2
  Top 0.406: Q1.3 9.38,60.87 R21.2
N$3
  Top 0.406: Q2.2 21.5,57.35 R22.1 24.15,57.5 C16.1
N$5
  Top 0.406: R24.2 17.05,59.6 Q2.3
N$6  (via drill 0.6)
  other vias: 16.76,30.86
N$8
  Top 0.406: R26.1 C16.2 27.95,57.4 Q3.1
N$9
  Top 0.406: Q3.2 33,57.35 R25.1 36.15,57.5 C17.1
N$10
  Top 0.406: R11.2 R8.1 | IC2.3 50.42,15.15 50.42,16.76 49.91,17.27 47.62,17.27 47.37,17.53 47.37,18.56 R8.1 | 47.34,18.45 R8.1
N$11
  Top 0.406: R10.2 R9.1 50.5,17.83 51.56,16.76 51.56,15.17 IC2.2
N$12
  Top 0.406: R11.1 45.6,21.45 C9.1
N$13
  Top 0.406: R10.1 54.36,20.35 | 54.36,20.35 C4.2 | IC2.1 54.36,16.55 54.36,20.35
N$14
  Top 0.406: C4.1 R12.2
N$15
  Top 0.406: Q3.3 32.05,59.65 R27.2
N$16
  Top 0.406: R29.1 C17.2 40.45,57.4 Q4.1
N$17
  Top 0.406: Q4.2 44.5,57.35 R28.1 47.15,57.5 C18.1
N$18
  Top 0.406: 43.55,59.65 Q4.3 43.56,59.66 43.56,60.83 43.9,61.17 R30.2
N$19
  Top 0.406: R32.1 C18.2 51.45,57.4 Q5.1
N$20
  Top 0.406: Q5.2 55.5,57.35 R31.1 57.65,57.5 C19.1
N$21
  Top 0.406: R42.2 9.2,33.78 D5.3
N$23
  Top 0.406: Q5.3 54.55,59.65 R33.2
N$24
  Top 0.406: C19.2 D6.3 66.85,57.5 R34.2 C20.1
N$25
  Top 0.406: Q7.1 69.45,48.6 C24.2 R39.1
N$26
  Top 0.406: Q6.1 56.95,48.6 C23.2 R41.1
N$27
  Top 0.406: C24.1 65,48.45 R36.1 61.95,48.5 Q6.2
N$29  (via drill 0.6)
  Top 0.406: 71.35,48.4 Q7.2 74.45,48.5 R38.1 74.55,48.5 v72.9,48.51 | C25.1 v72.64,53.98
  Bottom 0.406: v72.64,53.98 72.64,48.77 v72.9,48.51
N$30
  Top 0.406: 70.55,50.75 Q7.3 70.77,50.7 70.99,50.93 72.27,50.93 R40.2
N$31
  Top 0.406: Q6.3 58.4,51.1 R37.2
N$32
  Top 0.406: LED3.K 42.5,8.15 R14.2
N$33
  Top 0.406: Q2.1 17.05,57.4 R23.1 14.5,57.35 C15.2
N$43
  Top 0.406: D4.3 7.68,38.58 R43.2
N$45
  Top 0.813: S3.6 S3.3
N$46
  Top 0.813: S4.4 S4.7
N$47
  Top 0.406: C15.1 12.55,57.4 | Q1.2 10.55,57.5 C15.1 | C15.1 R19.1
N$50
  Top 0.813: S5.4 S5.7
OUT1
  Top 0.406: FB2.2 64.9,27.03 64.9,25.02 63.25,23.37 63.25,20.07 64.7,18.61 J3.T
OUT3
  Top 0.406: IC2.6 IC2.7 | 62.48,33.63 C7.2 62.5,31.89 60.33,29.72 60.33,17.53 55.24,12.45 52.32,12.45 51.69,11.81 51.69,9.95 IC2.7 | IC2.7 51.61,9.88
P1F3  (via drill 0.6)
  Top 0.406: R21.1 11.09,62.74 v12.57,62.74 | v14.73,47.88 14.71,47.91 IC4.3
  Bottom 0.406: v12.57,62.74 13.59,61.72 13.59,51.82 14.73,50.67 v14.73,47.88
P1R1  (via drill 0.6)
  Top 0.406: 19.05,45.34 IC4.12 17.68,45.37 16.76,44.45 16.76,41.53 19.05,39.24 19.05,37.47 18.29,36.7 v14.73,36.7 | D5.1 8.05,28.76 C3.2 8.02,27.41 8.64,26.8 16.64,26.8 18.54,28.7 24.89,28.7 26.42,27.18 34.42,27.18 34.92,26.67 34.92,22.23 34.29,21.59 30.35,21.59 29.65,20.89 C12.2 | v11.18,35.94 10.16,34.92 6.99,34.92 6.56,35.35 D4.2 5.48,33.13 7.11,31.5 7.94,31.5 D5.1 | D5.1 8,31.43 | C12.2 29.72,19.67 | IC1.7 29.84,17.12 29.84,18.54 29.65,18.74 C12.2
  Bottom 0.406: v14.73,36.7 13.97,35.94 v11.18,35.94
P1R2
  Top 0.406: IC4.5 12.95,45.34 | IC4.5 12.79,45.22 | IC4.2 12.9,49.15 11.3,49.15 10.92,48.77 10.92,44.96 | 10.92,42.16 10.92,38.35 14.73,34.54 14.73,31.44 R6.2 14.65,30.05 15.11,29.59 25.15,29.59 26.67,28.07 35.31,28.07 35.81,27.56 35.81,21.72 34.8,20.7 31.62,20.7 31.37,20.45 31.37,19.88 31.43,19.81 C12.1 31.35,18.78 31.11,18.54 31.11,17.12 IC1.6 31.11,17.08 31.11,15.62 33.53,13.21 35.1,13.21 R4.2 | 10.92,42.16 10.92,44.96 | 10.92,44.96 11.33,45.37 IC4.5 | R5.2 10.92,42.16
P2F1  (via drill 0.6)
  Top 0.406: C22.1 C21.2 R34.1 66.95,55.6 v65.59,55.6 | 47.05,46.61 IC5.13 47.1,46.61 48.39,46.61 48.9,47.12 v48.9,51.94
  Bottom 0.406: v65.59,55.6 52.17,55.6 52.15,55.63 51.18,55.63 48.9,53.34 v48.9,51.94
P2F2  (via drill 0.6)
  Top 0.406: IC5.1 40.9,50.42 | 52.58,48.67 C23.1 51.35,48.6 v51.31,48.64 | IC5.1 40.89,50.48 | IC5.1 40.95,50.42 v43.05,50.42
  Bottom 0.406: v43.05,50.42 47.24,46.23 50.16,46.23 51.31,47.37 v51.31,48.64
P2F3  (via drill 0.6)
  Top 0.406: R35.2 C20.2 v68.45,61.34 | 40.77,47.75 IC5.3 40.95,47.88 v43.05,47.88
  Bottom 0.406: v68.45,61.34 68.45,45.59 67.94,45.09 45.85,45.09 v43.05,47.88
P2R1  (via drill 0.6)
  Top 0.406: R7.1 19.04,35.31 20.19,35.31 22.61,32.89 v22.86,32.89 | IC5.12 47.1,45.34 49.02,45.34 49.66,44.7 49.66,36.2 48.64,35.18 v48.64,30.35
  Bottom 0.406: v22.86,32.89 22.86,30.23 25.15,27.94 48.26,27.94 48.51,28.19 48.51,30.23 v48.64,30.35
P2R2
  Top 0.406: C5.2 38.33,49.17 IC5.2
P2R3
  Top 0.406: IC5.5 40.9,45.34 40.77,45.47 40.65,45.34 39.37,45.34 38.48,44.45 38.48,40.77 39.62,39.62 39.62,37.72 40.51,36.83 41.78,36.83 42.93,35.69 42.93,29.72 44.83,27.81 53.47,27.81 55.12,26.16 55.12,22.86 55.75,22.23 57.53,22.23 58,21.76 R12.1
P11
  Top 0.406: IC4.14 19.1,47.88 21.34,47.88 21.97,47.24 21.97,39.88 22.23,39.62 P1.P$1
P12
  Top 0.406: IC4.15 17.17,49.17 15.75,47.75 15.75,41.02 17.5,39.27 P1.P$2
P13
  Top 0.406: P1.P$3 14.86,40.52 14.86,45.97 14.2,46.63 IC4.4
P21
  Top 0.406: IC5.14 47.05,47.88 45.72,47.88 45.47,47.62 45.47,39.88 46.86,38.48 P2.P$1
P22
  Top 0.406: IC5.15 47.1,49.15 | IC5.15 47.05,49.15 | P2.P$2 44.58,40.56 44.58,48.26 45.49,49.17 IC5.15
P23
  Top 0.406: 40.9,46.61 IC5.4 37.62,46.63 36.96,45.97 36.96,39.62 37.83,38.75 P2.P$3
P32
  Top 0.406: C8.2 69.27,34.75 67.56,36.45 67.56,38.42 P3.P$2
P33
  Top 0.61: C7.1 62.61,35.46 62.61,36.96 62.83,37.18 P3.P$3
RGER
  Top 0.406: D3.C D2.A 52.49,25.19 S1.3
RIN
  Top 0.406: 33.1,45.34 IC3.12 34.14,45.37 34.67,44.83 34.67,40.64 33.53,39.5 33.53,36.83 36.7,33.66 36.7,19.94 35.56,18.8 35.56,18.16 35.18,17.78 34.29,17.78 R3.1 34.16,17.65 33.53,17.65 32.98,17.1 IC1.5
RIN2
  Top 0.406: R4.1 36.86,13.52 C13.1
RIN3  (via drill 0.6)
  Top 0.406: C3.1 9.88,28.57 v16.51,28.57 | R7.2 18.92,33.57 v18.92,31.75
  Bottom 0.406: v18.92,31.75 18.92,30.99 v16.51,28.57
RLED
  Top 0.406: LED2.C LED1.A 53.59,38.2 53.59,37.08 52.6,36.09 S1.1
ROUT  (via drill 0.6)
  Top 0.406: 26.91,45.35 IC3.5 26.95,45.34 v28.7,45.34 | 33.91,52.32 C6.1 32.52,52.34 v32.51,52.32
  Bottom 0.406: v28.7,45.34 32.51,49.15 v32.51,52.32
ROUT1  (via drill 0.6)
  Top 0.406: S1.5 S1.2 50.67,31.94 v50.67,43.94 | C6.2 35.63,52.32 38.35,52.32 | C5.1 38.35,50.94 38.35,52.32 | 38.35,52.32 v39.5,52.32
  Bottom 0.406: v39.5,52.32 39.5,49.78 45.21,44.07 50.55,44.07 v50.67,43.94
SEL  (via drill 0.6)
  Top 0.406: IC3.11 IC3.10 IC3.9 33.05,41.53 31.37,41.53 30.86,41.02 30.86,37.85 29.97,36.96 25.02,36.96 | IC4.11 IC4.10 IC4.9 19.18,41.45 19.18,40.64 20.57,39.24 20.57,37.97 21.59,36.96 25.02,36.96 | IC5.11 IC5.10 IC5.9 | S2.5 S2.2 25.02,32.59 25.02,36.96 | IC5.9 47.12,41.51 47.13,41.53 | v47.5,28.96 47.5,36.07 48.77,37.34 48.77,41.02 48.23,41.55 IC5.9
  Bottom 0.406: v47.5,28.96 35.05,28.96 34.01,30 S2.5
VON  (via drill 0.6)
  Top 0.406: R42.1 12.91,31.39 | 12.91,31.39 R6.1 v12.95,29.98 v12.95,29.97 | 12.91,31.39 9.96,31.39 D5.2 | R9.2 50.5,22.27 v50.42,22.35
  Bottom 0.406: v12.95,29.97 12.95,29.21 14.99,27.18 46.35,27.18 50.42,23.11 v50.42,22.35
VOP  (via drill 0.6)
  Top 0.406: D4.1 5.46,37.27 5.46,39.5 6.31,40.35 R43.1 | R8.2 45.64,17.95 44.32,16.64 41.78,16.64 41.02,17.4 41.02,22.1 39.5,23.62 v39.5,35.18 | v9.53,40.26 7.83,40.26 R43.1 | R43.1 7.71,40.38 R5.1
  Bottom 0.406: v9.53,40.26 9.53,36.07 11.05,34.54 23.88,34.54 26.42,32 36.32,32 v39.5,35.18

### Text on the board
Measures: 5x PTH 2.8 x 1 mm | 1x PTH 3.4 x 1 mm
_tsilk: JP1 | +9V | +4V5 | 1 | BS1 | - | CF1 | LSP13 | 1 | + | D1 | R16 | J1 | R21 | C11 | RezzFuzz v2.0 | R17 | C10 | R19 | R26 | R29 | R32 | R33 | C20 | G3 | R20 | R24 | R35 | R30 | LSP13 | C14 | R27 | R22 | Q1 | C16 | R28 | C18 | C19 | JP4 | C15 | Q2 | Q3 | C17 | Q4 | Q5 | D6 | JP5 | R23 | R25 | R31 | R34 | C21 | C22 | C29 | GND | 9V | C28 | C6 | C30 | R41 | C25 | FX1O | R39 | R40 | 4V5 | R37 | C5 | GND | FX1I | C23 | C24 | Q6 | Q7 | FX2O | GND | R36 | R38 | 1 | 1 | R5 | IC4 | R18 | P1 | IC3 | IC5 | P2 | P3 | R43 | LED1 | LED2 | R15 | D4 | C7 | C8 | R42 | R7 | R6 | G1 | D5 | G2 | LSP13 | LSP13 | C3 | D3 | D2 | FB2 | S2 | S1 | R11 | C12 | R3 | J2 | C9 | R8 | R9 | C4 | R10 | R12 | 1 | J3 | C26 | 1 | R2 | C13 | LED3 | C1 | R4 | IC1 | IC2 | C27 | R14 | R1 | C2 | FXI | IN | GND | FXO | LED | OUT | R13 | FB1 | JP2 | Feb/2013 | Rezzonics
_bsilk: P1 | P2 | P3 | S2 | S1 | RezzFuzz v2.0 | Rezzonics | LED3